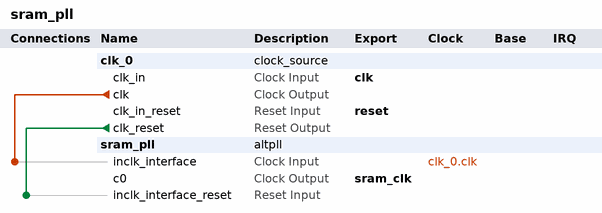
[diagram p0: system contents]
# Platform Designer (Qsys) system sram_pll, Cyclone IV E EP4CE115F29C7
# Parameters at their usual value, and those the tool derives, are not listed.
package require -exact qsys 18.1
create_system sram_pll
set_project_property DEVICE_FAMILY {Cyclone IV E}
set_project_property DEVICE EP4CE115F29C7

add_instance clk_0 clock_source 18.1
set_instance_parameter_value clk_0 clockFrequency 50000000

add_instance sram_pll altpll 18.1
set_instance_parameter_value sram_pll CLK0_DIVIDE_BY 1
set_instance_parameter_value sram_pll CLK0_MULTIPLY_BY 2
set_instance_parameter_value sram_pll INCLK0_INPUT_FREQUENCY 20000
set_instance_parameter_value sram_pll PORT_ARESET PORT_UNUSED
set_instance_parameter_value sram_pll PORT_LOCKED PORT_UNUSED
set_instance_parameter_value sram_pll PORT_clk1 PORT_UNUSED
set_instance_parameter_value sram_pll PORT_clk2 PORT_UNUSED
set_instance_parameter_value sram_pll PORT_clk3 PORT_UNUSED

# connections
add_connection clk_0.clk sram_pll.inclk_interface clock
add_connection clk_0.clk_reset sram_pll.inclk_interface_reset reset

# exported interfaces
add_interface clk clock sink
set_interface_property clk EXPORT_OF clk_0.clk_in
add_interface reset reset sink
set_interface_property reset EXPORT_OF clk_0.clk_in_reset
add_interface sram_clk clock source
set_interface_property sram_clk EXPORT_OF sram_pll.c0

set_interconnect_requirement {$system} qsys_mm.clockCrossingAdapter HANDSHAKE
set_interconnect_requirement {$system} qsys_mm.enableEccProtection FALSE
set_interconnect_requirement {$system} qsys_mm.insertDefaultSlave FALSE
set_interconnect_requirement {$system} qsys_mm.maxAdditionalLatency 1

save_system sram_pll.qsys
